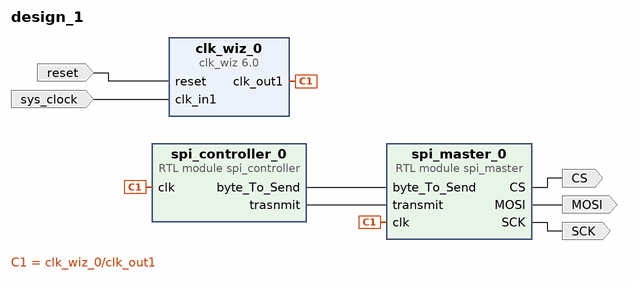
[diagram p0: block diagram of the top level]
# Vivado block design design_1, xc7a35tcpg236-1, Vivado 2022.2
create_bd_design design_1

create_bd_port -dir I -type clk sys_clock
set_property -dict {CONFIG.FREQ_HZ 100000000 CONFIG.PHASE 0.0} [get_bd_ports sys_clock]
create_bd_port -dir I -type rst reset
set_property -dict {CONFIG.POLARITY ACTIVE_HIGH} [get_bd_ports reset]
create_bd_port -dir O SCK
create_bd_port -dir O CS
create_bd_port -dir O MOSI

create_bd_cell -type ip -vlnv xilinx.com:ip:clk_wiz:6.0 clk_wiz_0
set_property -dict [list \
  CONFIG.CLKOUT1_JITTER 631.442 \
  CONFIG.CLKOUT1_PHASE_ERROR 346.848 \
  CONFIG.CLKOUT1_REQUESTED_OUT_FREQ 5 \
  CONFIG.CLKOUT2_JITTER 270.159 \
  CONFIG.CLKOUT2_PHASE_ERROR 128.132 \
  CONFIG.CLKOUT2_REQUESTED_OUT_FREQ 5 \
  CONFIG.CLKOUT2_USED false \
  CONFIG.CLK_IN1_BOARD_INTERFACE sys_clock \
  CONFIG.MMCM_CLKFBOUT_MULT_F 32.000 \
  CONFIG.MMCM_CLKOUT0_DIVIDE_F 128.000 \
  CONFIG.MMCM_CLKOUT1_DIVIDE 1 \
  CONFIG.MMCM_DIVCLK_DIVIDE 5 \
  CONFIG.NUM_OUT_CLKS 1 \
  CONFIG.RESET_BOARD_INTERFACE reset \
  CONFIG.USE_BOARD_FLOW true \
] [get_bd_cells clk_wiz_0]
create_bd_cell -type module -reference spi_controller spi_controller_0
create_bd_cell -type module -reference spi_master spi_master_0

# ---- connections ----

connect_bd_net [get_bd_pins clk_wiz_0/clk_out1] [get_bd_pins spi_controller_0/clk] [get_bd_pins spi_master_0/clk]
connect_bd_net [get_bd_ports reset] [get_bd_pins clk_wiz_0/reset]
connect_bd_net [get_bd_pins spi_controller_0/byte_To_Send] [get_bd_pins spi_master_0/byte_To_Send]
connect_bd_net [get_bd_pins spi_controller_0/trasnmit] [get_bd_pins spi_master_0/transmit]
connect_bd_net [get_bd_pins spi_master_0/CS] [get_bd_ports CS]
connect_bd_net [get_bd_pins spi_master_0/MOSI] [get_bd_ports MOSI]
connect_bd_net [get_bd_pins spi_master_0/SCK] [get_bd_ports SCK]
connect_bd_net [get_bd_ports sys_clock] [get_bd_pins clk_wiz_0/clk_in1]

set_property USER_COMMENTS.comment_1 {5 MHz} [current_bd_design]
set_property USER_COMMENTS.comment_2 {5 MHz} [current_bd_design]

validate_bd_design
save_bd_design
